# Altium schematic sheet Mainboard_PWR Board Connector.SchDoc
size A4
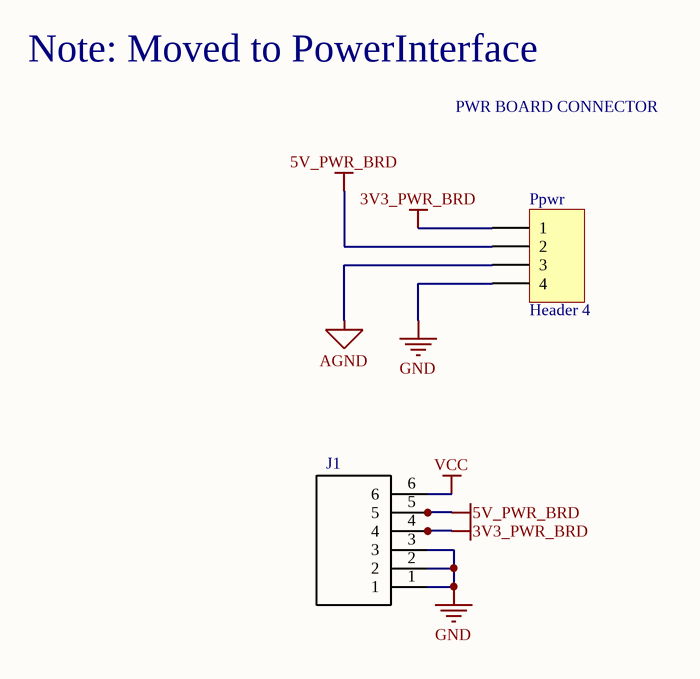
[diagram p0: Mainboard_PWR Board Connector.SchDoc]

## Parts
J1  CN HEADER VERT 6POS 3.96MM  [CN HDR 6POS 3.96MM]  (value not drawn)
Ppwr  Header 4  [HDR1X4]

## Nets
3V3_PWR_BRD: J1.4 Ppwr.1
5V_PWR_BRD: J1.5 Ppwr.2
AGND: Ppwr.3
GND: J1.1 J1.2 J1.3 Ppwr.4
VCC: J1.6

## Notes on the sheet
- Note: Moved to PowerInterface
- PWR BOARD CONNECTOR

## Library data of the parts
J1 = CN HDR VERT 6POS 3.96MM: Connector Header Through Hole 6 position 0.156" (3.96mm); MF: TE Connectivity; MP: 1877285-6; Current Rating: 7.5A; Voltage Rating: 250VAC; SnapEDA_Link: https://www.snapeda.com/parts/1877285-6/TE%20Connectivity/view-part/2371244/?ref=snap; Digikey: A99849-ND; Digikey Link: https://www.digikey.ca/product-detail/en/te-connectivity-amp-connectors/1877285-6/A99849-ND/2000097
Ppwr = Header 4: Header, 4-Pin; LatestRevisionDate: 17-Jul-2002; LatestRevisionNote: Re-released for DXP Platform.; Publisher: Altium Limited